# EAGLE design Clock Multiplexer (EAGLE 7.6.0)
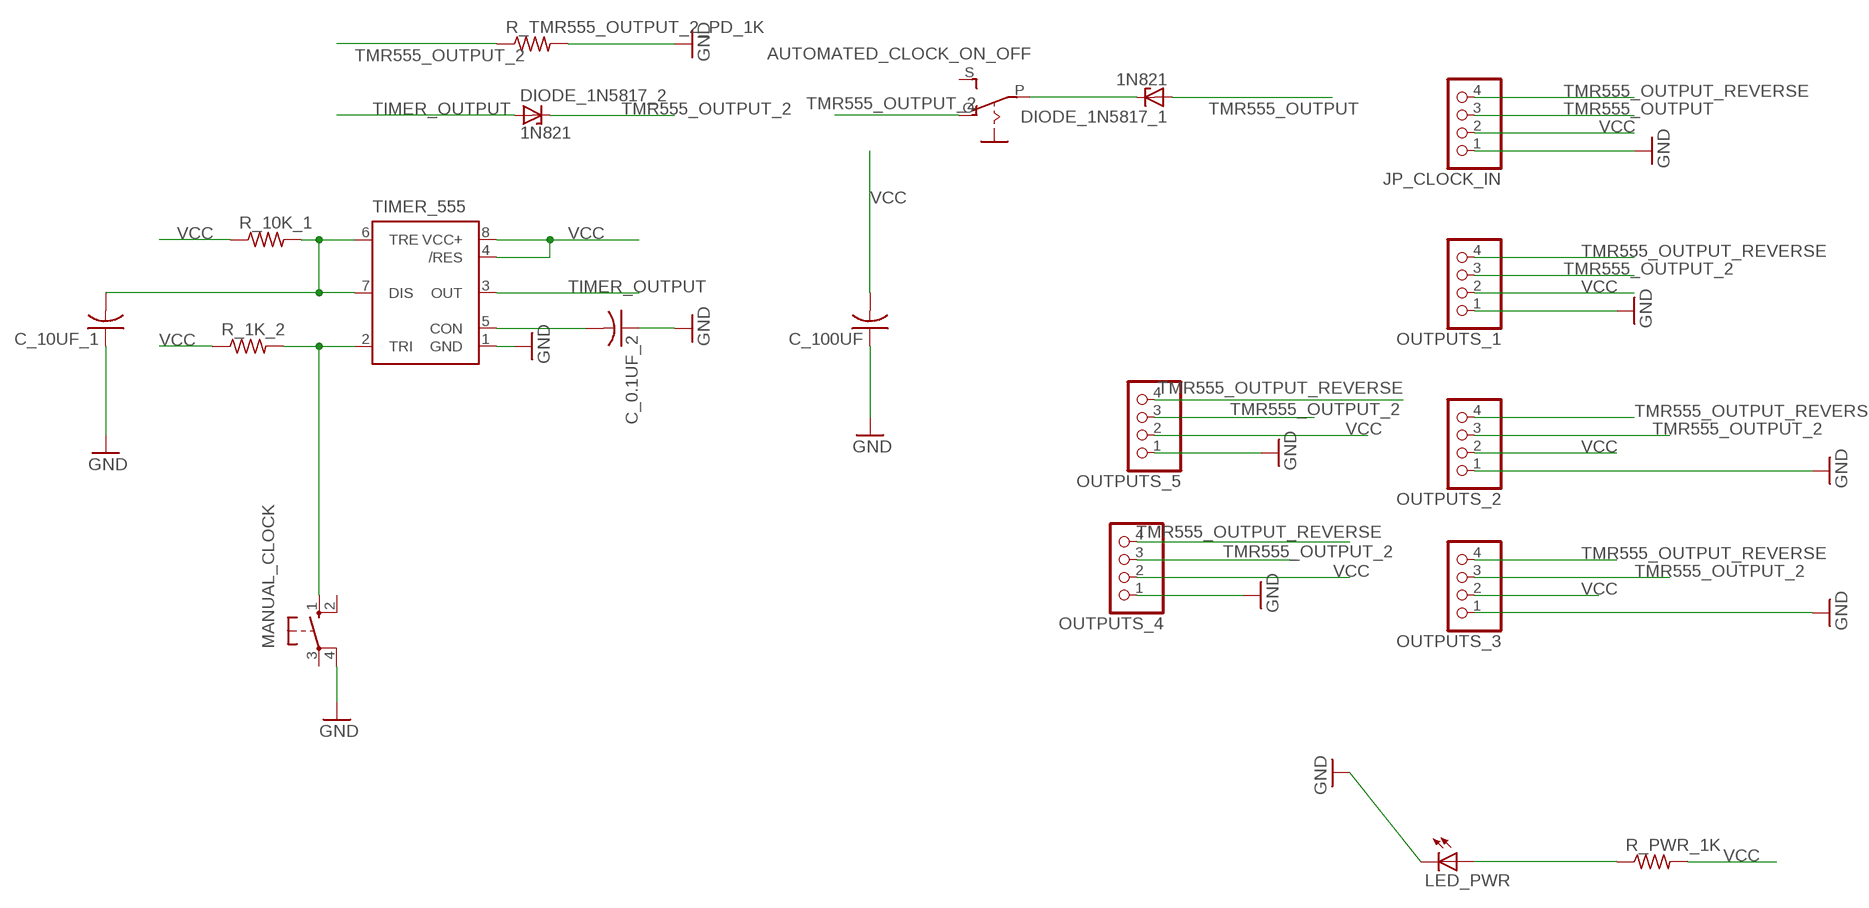
[diagram p0: schematic, sheet 1]

## Parts
AUTOMATED_CLOCK_ON_OFF  EG1218S  [EG1218]
C_0.1UF_2  C-USC1206  [C1206]
C_10UF_1  C-USC1206  [C1206]
C_100UF  C-US025-030X050  [C025-030X050]
DIODE_1N5817_1  1N821  [DO35Z10]
DIODE_1N5817_2  1N821  [DO35Z10]
JP_CLOCK_IN  PINHD-1X4  [1X04]
LED_PWR  LEDSMT1206  [1206]
MANUAL_CLOCK  10-XX  [B3F-10XX]
OUTPUTS_1  PINHD-1X4  [1X04]
OUTPUTS_2  PINHD-1X4  [1X04]
OUTPUTS_3  PINHD-1X4  [1X04]
OUTPUTS_4  PINHD-1X4  [1X04]
OUTPUTS_5  PINHD-1X4  [1X04]
R_1K_2  R-US_R1206  [R1206]
R_10K_1  R-US_R1206  [R1206]
R_PWR_1K  R-US_R1206  [R1206]
R_TMR555_OUTPUT_2_PD_1K  R-US_R1206  [R1206]
TIMER_555  NE555D  [SO08]

## Nets
GND: C_0.1UF_2.1 C_10UF_1.1 C_100UF.1 JP_CLOCK_IN.1 LED_PWR.C MANUAL_CLOCK.4(P1) OUTPUTS_1.1 OUTPUTS_2.1 OUTPUTS_3.1 OUTPUTS_4.1 OUTPUTS_5.1 R_TMR555_OUTPUT_2_PD_1K.2 TIMER_555.1(GND)
N$1: LED_PWR.A R_PWR_1K.1
N$2: AUTOMATED_CLOCK_ON_OFF.P DIODE_1N5817_1.C
N$3: C_10UF_1.2 R_10K_1.2 TIMER_555.6(TRE) TIMER_555.7(DIS)
N$4: C_0.1UF_2.2 TIMER_555.5(CON)
N$5: MANUAL_CLOCK.1(S) R_1K_2.2 TIMER_555.2(TRI)
TIMER_OUTPUT: DIODE_1N5817_2.A TIMER_555.3(OUT)
TMR555_OUTPUT: DIODE_1N5817_1.A JP_CLOCK_IN.3
TMR555_OUTPUT_2: AUTOMATED_CLOCK_ON_OFF.O DIODE_1N5817_2.C OUTPUTS_1.3 OUTPUTS_2.3 OUTPUTS_3.3 OUTPUTS_4.3 OUTPUTS_5.3 R_TMR555_OUTPUT_2_PD_1K.1
TMR555_OUTPUT_REVERSE: JP_CLOCK_IN.4 OUTPUTS_1.4 OUTPUTS_2.4 OUTPUTS_3.4 OUTPUTS_4.4 OUTPUTS_5.4
VCC: C_100UF.2 JP_CLOCK_IN.2 OUTPUTS_1.2 OUTPUTS_2.2 OUTPUTS_3.2 OUTPUTS_4.2 OUTPUTS_5.2 R_1K_2.1 R_10K_1.1 R_PWR_1K.2 TIMER_555.4(/RES) TIMER_555.8(VCC+)
Unconnected: AUTOMATED_CLOCK_ON_OFF.S MANUAL_CLOCK.2(S1) MANUAL_CLOCK.3(P)

## Library data of the parts
AUTOMATED_CLOCK_ON_OFF = adafruit:EG1218: SLIDING SWITCH 0.1" spacing through hole, vertical SPDT slide switch http://www.ladyada.net/library/pcb/eaglelibrary.html
C_0.1UF_2 C_10UF_1 C_100UF = adafruit:C-US: CAPACITOR, American symbol
DIODE_1N5817_1 DIODE_1N5817_2 = diode:1N821: Reference DIODE temperature compensated, 6,2 V
JP_CLOCK_IN OUTPUTS_1-OUTPUTS_5 = pinhead:PINHD-1X4: PIN HEADER
LED_PWR = adafruit:LED: LED OSRAM: - CHIPLED LG R971, LG N971, LY N971, LG Q971, LY Q971, LO R971, LY R971 LH N974, LH R974 LS Q976, LO Q976, LY Q976 LO Q996 - Hyper CHIPLED LW Q18S LB Q993, LB Q99A, LB R99A - SideLED LS A670, LO A670, LY A670, LG A670, LP A670 LB A673, LV A673, LT A673, LW A673 LH A674 LY A675 LS A676, LA A676, LO A676, LY A676, LW A676 LS A679, LY A679, LG A679 - Hyper Micro SIDELED® LS Y876, LA Y876, LO Y876, LY Y876 LT Y87S - SmartLED LW L88C, LW L88S LB L89C, LB L89S, LG L890 LS L89K, LO L89K, LY L89K LS L896, LA L896, LO L896, LY L896 - TOPLED LS T670, LO T670, LY T670, LG T670, LP T670 LSG T670, LSP T670, LSY T670, LOP T670, LYG T670 LG T671, LOG T671, LSG T671 LB T673, LV T673, LT T673, LW T673 LH T674 LS T676, LA T676, LO T676, LY T676, LB T676, LH T676, LSB T676, LW T676 LB T67C, LV T67C, LT T67C, LS T67K, LO T67K, LY T67K, LW E67C LS E67B, LA E67B, LO E67B, LY E67B, LB E67C, LV E67C, LT E67C LW T67C LS T679, LY T679, LG T679 LS T770, LO T770, LY T770, LG T770, LP T770 LB T773, LV T773, LT T773, LW T773 LH T774 LS E675, LA E675, LY E675, LS T675 LS T776, LA T776, LO T776, LY T776, LB T776 LHGB T686 LT T68C, LB T68C - Hyper Mini TOPLED® LB M676 - Mini TOPLED Santana® LG M470 LS M47K, LO M47K, LY M47K Source: http://www.osram.convergy.de/
MANUAL_CLOCK = switch-omron:10-XX: OMRON SWITCH; MPN: B3F-1000; OC_FARNELL: 176432; OC_NEWARK: 36M3542
R_1K_2 R_10K_1 R_PWR_1K R_TMR555_OUTPUT_2_PD_1K = adafruit:R-US_: RESISTOR, American symbol
TIMER_555 = SparkFun-AnalogIC:NE555: General purpose bipolar Timer

## Board
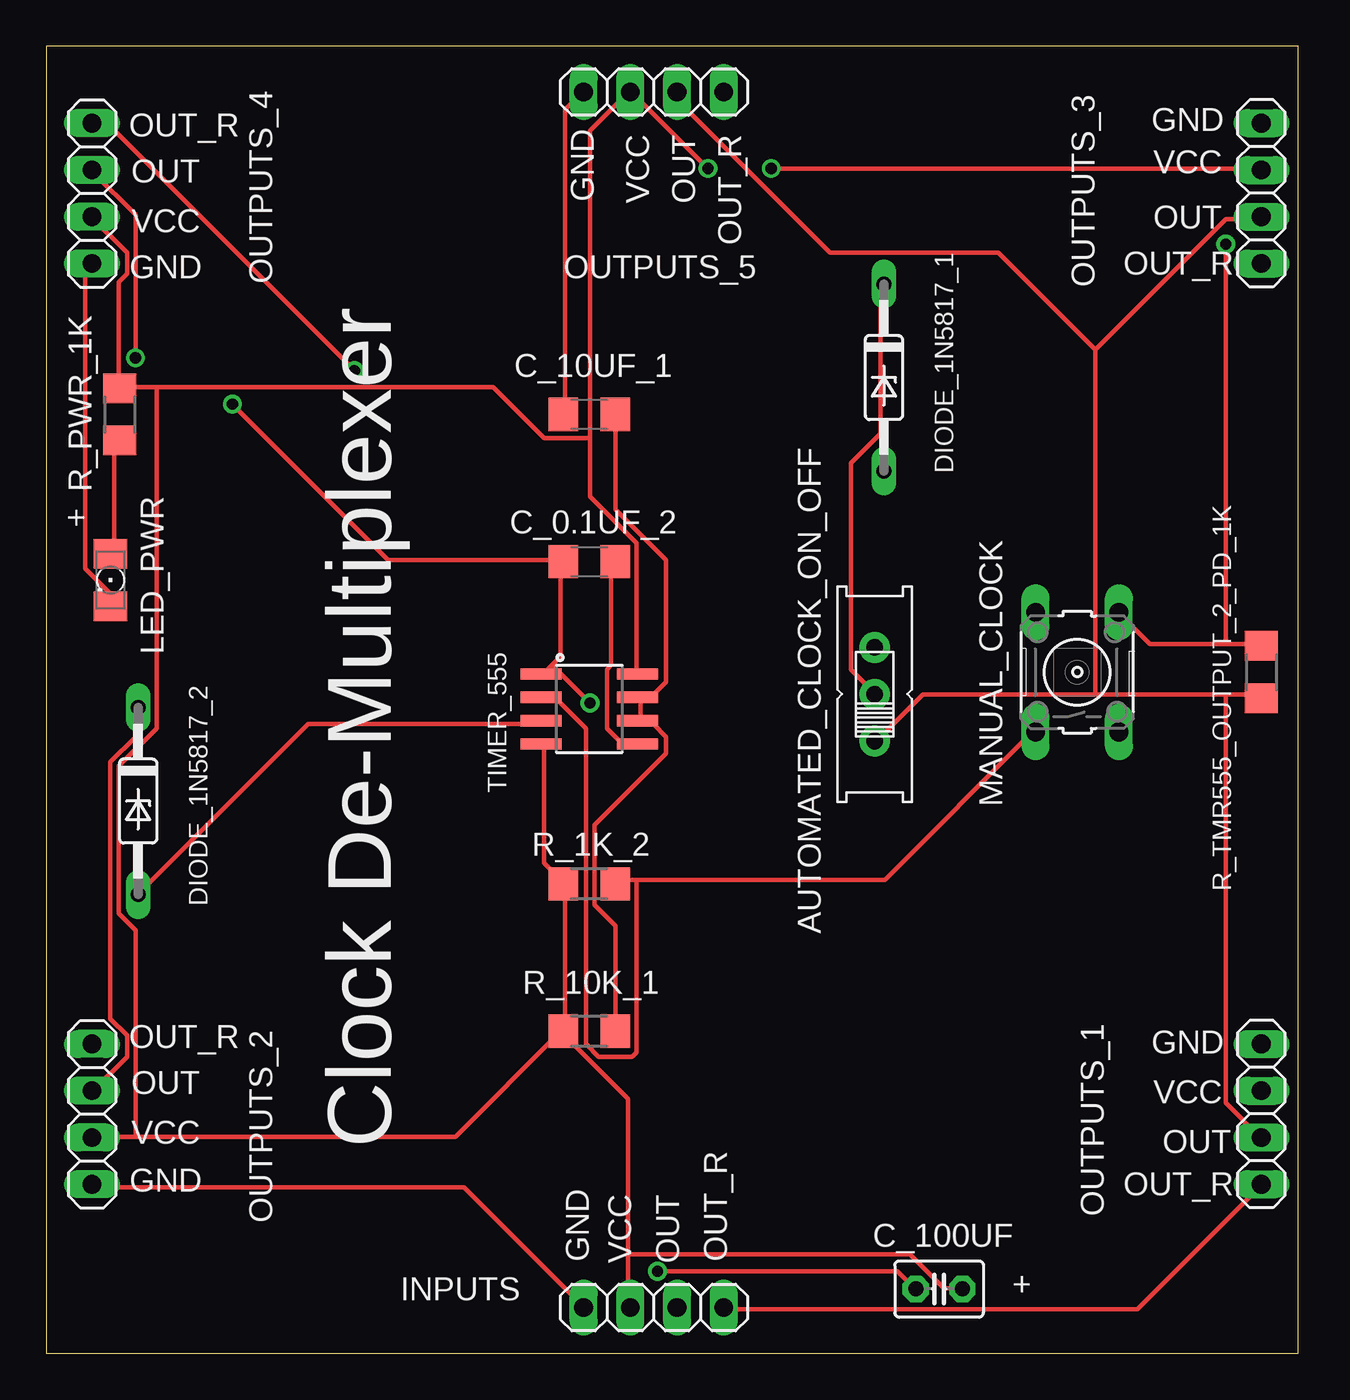
[diagram p1: board, top side]
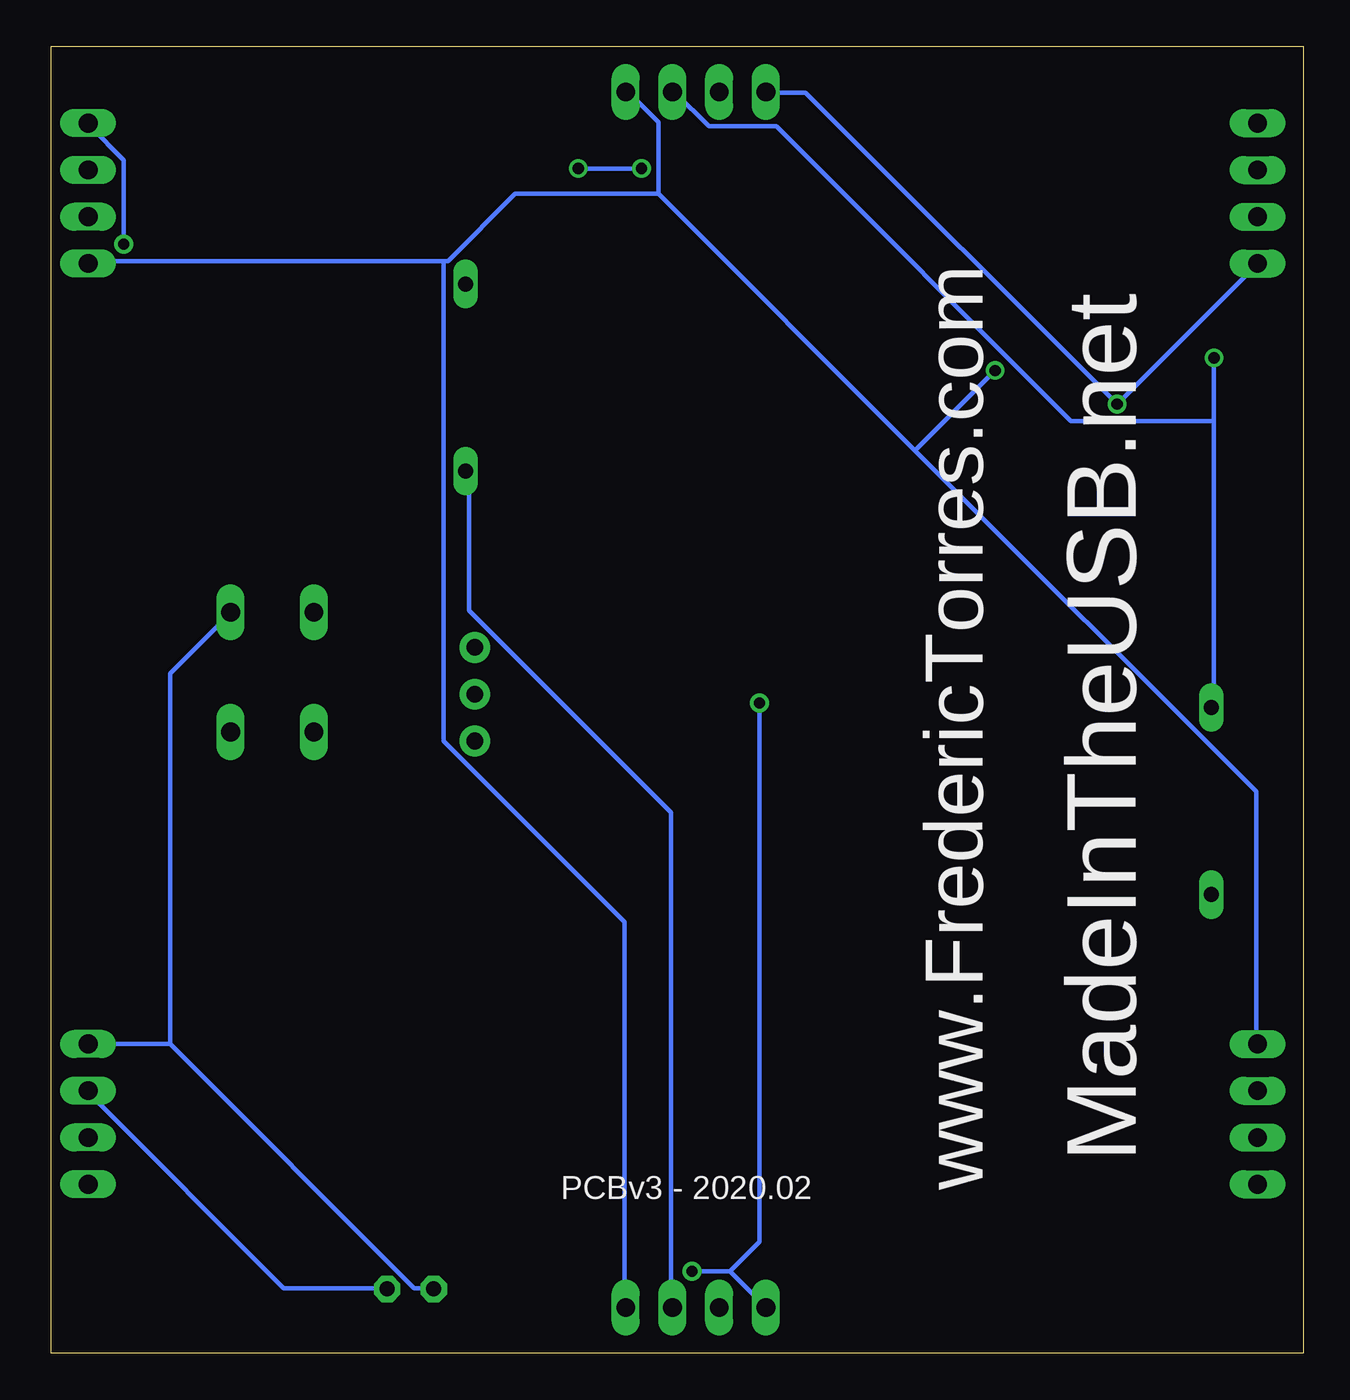
[diagram p2: board, bottom side, seen from below]

Size 68 x 71 mm. Coordinates in mm from the lower left corner, seen from the top.
Outline: 0,0 68,0 68,71 0,71 0,0
Copper layers (1*16): Top 0.035mm / dielectric 1.5mm / Bottom 0.035mm
Design rules "default": minimum track width 10mil, minimum drill 24mil, track to track 8mil, track to pad 8mil, pad to pad 8mil, via to via 8mil, smd to smd 8mil, copper to edge 40mil, drill to drill 8mil, minimum pad ring 10mil, minimum via ring 8mil, stop-mask expansion 4mil, vias tented up to drill 0mil, thermal gap 10mil

### Footprints (pad centres in the part's own frame; a part is rotated, then mirrored left to right if it is on the bottom)
EG1218 = drill 0.9 pad 1.676: O -2.54,0; P 0,0; S 2.54,0
C1206 = smd 1.6 x 1.8: 1 -1.4,0; 2 1.4,0
C025-030X050 = drill 0.813 pad 1.422 octagon: 1 -1.27,0; 2 1.27,0
DO35Z10 = drill 0.813 long: A 5.08,0; C -5.08,0
1X04 = drill 1.016 long: 1 -3.81,0; 2 -1.27,0; 3 1.27,0; 4 3.81,0
1206 = smd 1.6 x 1.803: A -1.422,0; C 1.422,0
B3F-10XX = drill 1.016 long: 1 -3.251,2.261; 2 3.251,2.261; 3 -3.251,-2.261; 4 3.251,-2.261
R1206 = smd 1.6 x 1.803: 1 -1.422,0; 2 1.422,0
SO08 = smd 0.61 x 2.21: 1 -1.905,-2.616; 2 -0.635,-2.616; 3 0.635,-2.616; 4 1.905,-2.616; 5 1.905,2.616; 6 0.635,2.616; 7 -0.635,2.616; 8 -1.905,2.616

### Placement (x,y rotation side)
AUTOMATED_CLOCK_ON_OFF  45,35.8 90 top
C_0.1UF_2  29.5,43 0 top
C_10UF_1  29.5,51 0 top
C_100UF  48.5,3.5 0 top
DIODE_1N5817_1  45.5,53 270 top
DIODE_1N5817_2  5,30 270 top
JP_CLOCK_IN  33,2.5 0 top
LED_PWR  3.5,42 270 top
MANUAL_CLOCK  56,37 90 top
OUTPUTS_1  66,13 270 top
OUTPUTS_2  2.5,13 90 top
OUTPUTS_3  66,63 270 top
OUTPUTS_4  2.5,63 90 top
OUTPUTS_5  33,68.5 0 top
R_1K_2  29.5,25.5 0 top
R_10K_1  29.5,17.5 0 top
R_PWR_1K  4,51 90 top
R_TMR555_OUTPUT_2_PD_1K  66,37 90 top
TIMER_555  29.5,35 270 top

### Tracks (layer width: path | path; a pad name or v marks a point on that pad's centre or on a via)
GND  (via drill 0.61)
  Top 0.254: C_10UF_1.1 28.18,51.09 28.18,67.55 29.09,68.47 OUTPUTS_5.1 | 27.49,37.38 27.03,36.92 TIMER_555.1 | 27.49,37.38 27.95,37.84 27.95,42.86 C_0.1UF_2.1 27.95,43.09 18.57,43.09 v10.12,51.55 | LED_PWR.C 3.49,40.58 3.49,41.26 2.12,42.63 2.12,58.87 2.34,59.09 OUTPUTS_4.1 | OUTPUTS_2.1 2.57,9.03 22.69,9.03 29.09,2.63 JP_CLOCK_IN.1 | 64.06,38.52 59.95,38.52 58.35,40.12 MANUAL_CLOCK.4 | 64.06,38.52 65.89,38.52 R_TMR555_OUTPUT_2_PD_1K.2 | 64.06,38.52 v64.06,60.24 | v33.2,4.46 46.23,4.46 47.15,3.54 C_100UF.1 | v29.55,35.32 27.49,37.38
  Bottom 0.254: OUTPUTS_4.1 2.57,59.09 v10.12,51.55 27.03,68.47 29.09,68.47 OUTPUTS_5.1 | 61.55,16.8 48.29,3.54 47.38,3.54 C_100UF.1 | 61.55,16.8 65.89,16.8 OUTPUTS_1.1 | v64.06,60.24 64.06,64.81 65.89,66.64 OUTPUTS_3.1 | 61.55,16.8 61.55,36.92 58.35,40.12 MANUAL_CLOCK.4 | 31.15,4.46 29.32,2.63 JP_CLOCK_IN.1 | v33.2,4.46 31.15,4.46 | v29.55,35.32 29.55,6.06 31.15,4.46
N$1
  Top 0.254: LED_PWR.A 3.71,43.55 3.71,49.27 3.94,49.49 R_PWR_1K.1
N$2
  Top 0.254: DIODE_1N5817_1.C 45.32,57.95 45.32,49.95 43.72,48.35 43.72,37.15 44.86,36.01 AUTOMATED_CLOCK_ON_OFF.P
N$3
  Top 0.254: C_10UF_1.2 30.92,50.87 30.92,45.84 33.66,43.09 33.66,36.46 32.98,35.78 32.29,35.78 TIMER_555.7 32.29,35.55 32.29,34.41 TIMER_555.6 32.29,34.18 32.98,34.18 33.66,33.49 33.66,32.58 29.77,28.69 29.77,24.35 30.92,23.2 30.92,17.72 R_10K_1.2
N$4
  Top 0.254: C_0.1UF_2.2 30.69,42.86 30.69,37.38 30.46,37.15 30.46,33.95 31.15,33.26 32.06,33.26 TIMER_555.5
N$5
  Top 0.254: 32.06,25.72 45.55,25.72 53.55,33.72 MANUAL_CLOCK.1 | 32.06,25.72 31.15,25.72 R_1K_2.2 | 32.06,25.72 32.06,16.35 31.83,16.12 30,16.12 29.32,16.8 29.32,33.95 27.72,35.55 27.03,35.55 TIMER_555.2
TIMER_OUTPUT
  Top 0.254: TIMER_555.3 26.8,34.18 14.23,34.18 5.09,25.03 DIODE_1N5817_2.A
TMR555_OUTPUT
  Bottom 0.254: DIODE_1N5817_1.A 45.32,47.89 45.32,40.35 34.35,29.38 34.35,2.63 JP_CLOCK_IN.3
TMR555_OUTPUT_2  (via drill 0.61)
  Top 0.254: DIODE_1N5817_2.C 4.86,34.86 4.86,33.49 3.49,32.12 3.49,18.18 4.4,17.26 4.4,16.12 2.57,14.29 OUTPUTS_2.3 | v4.86,54.06 4.86,61.84 2.57,64.12 OUTPUTS_4.3 | 56.98,35.78 47.61,35.78 45.09,33.26 AUTOMATED_CLOCK_ON_OFF.O | 56.98,35.78 64.06,35.78 | 64.06,35.78 65.89,35.78 R_TMR555_OUTPUT_2_PD_1K.1 | 64.06,35.78 64.06,13.6 65.89,11.77 OUTPUTS_1.3 | 56.98,54.52 64.06,61.61 65.89,61.61 OUTPUTS_3.3 | 56.98,35.78 56.98,54.52 | 56.98,54.52 51.72,59.78 42.58,59.78 34.35,68.01 34.35,68.47 OUTPUTS_5.3
  Bottom 0.254: 4.86,50.64 4.86,35.09 DIODE_1N5817_2.C | 4.86,50.64 v4.86,54.06 | 4.86,50.64 12.63,50.64 28.63,66.64 32.29,66.64 34.12,68.47 OUTPUTS_5.3
TMR555_OUTPUT_REVERSE  (via drill 0.61)
  Top 0.254: JP_CLOCK_IN.4 36.86,2.4 59.27,2.4 65.89,9.03 OUTPUTS_1.4 | v16.75,53.38 3.49,66.64 2.57,66.64 OUTPUTS_4.4
  Bottom 0.254: 35.03,62.98 21.09,49.04 | 21.09,49.04 2.57,30.52 2.57,17.03 OUTPUTS_2.4 | 35.03,62.98 35.03,66.87 36.63,68.47 OUTPUTS_5.4 | 21.09,49.04 v16.75,53.38 | 46.69,59.32 46.46,59.32 42.81,62.98 35.03,62.98 | 46.69,59.32 65.89,59.32 OUTPUTS_3.4 | 46.69,59.32 46.69,33.26 36.86,23.43 36.86,2.63 JP_CLOCK_IN.4
VCC  (via drill 0.61)
  Top 0.254: TIMER_555.4 27.03,33.03 27.03,26.63 27.95,25.72 R_1K_2.1 28.18,25.49 28.18,17.72 R_10K_1.1 27.95,17.49 | 31.6,5.37 31.6,13.83 27.95,17.49 | 31.6,5.37 31.6,2.63 JP_CLOCK_IN.2 | 4.86,11.77 22.23,11.77 27.95,17.49 | 4.86,11.77 2.57,11.77 OUTPUTS_2.2 | 31.6,5.37 46.92,5.37 48.75,3.54 49.66,3.54 C_100UF.2 | OUTPUTS_4.2 2.57,61.61 4.4,59.78 4.4,58.64 3.94,58.18 3.94,52.47 R_PWR_1K.2 4.17,52.47 6,52.47 | 29.55,49.72 29.55,66.41 31.6,68.47 OUTPUTS_5.2 31.83,68.47 v35.95,64.35 | 29.55,49.72 29.55,46.52 32.06,44.01 32.06,36.92 TIMER_555.8 | v39.38,64.35 65.89,64.35 OUTPUTS_3.2 | 6,52.47 24.29,52.47 27.03,49.72 29.55,49.72 | 4.86,11.77 4.86,22.98 3.94,23.89 3.94,31.89 6,33.95 6,52.47
  Bottom 0.254: C_100UF.2 49.89,3.54 55.38,3.54 65.89,14.06 OUTPUTS_1.2 | v35.95,64.35 v39.38,64.35

### Text on the board
tNames: OUT_R | GND | GND | VCC | OUT | OUT_R | VCC | OUT | VCC | OUT | GND | OUT_R | + | Clock De-Multiplexer | OUT_R | GND | OUT | VCC | VCC | OUT | GND | OUT_R | GND | VCC | OUT | OUT_R | INPUTS | +
bNames: MadeInTheUSB.net | www.FredericTorres.com | PCBv3 - 2020.02